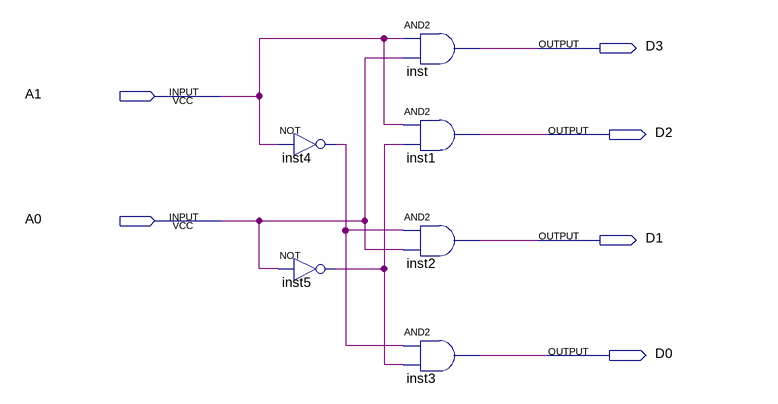
[diagram p0: schematic sheet]
// Quartus schematic DECODER.bdf as structural Verilog: 6 symbols, 6 pins
module DECODER (
  input  A1,
  input  A0,
  output D3,
  output D2,
  output D1,
  output D0
);

  wire inst4_out, inst5_out;

  not inst4 (inst4_out, A1);
  not inst5 (inst5_out, A0);
  and inst (D3, A1, A0);
  and inst1 (D2, A1, inst5_out);
  and inst2 (D1, inst4_out, A0);
  and inst3 (D0, inst4_out, inst5_out);
endmodule
